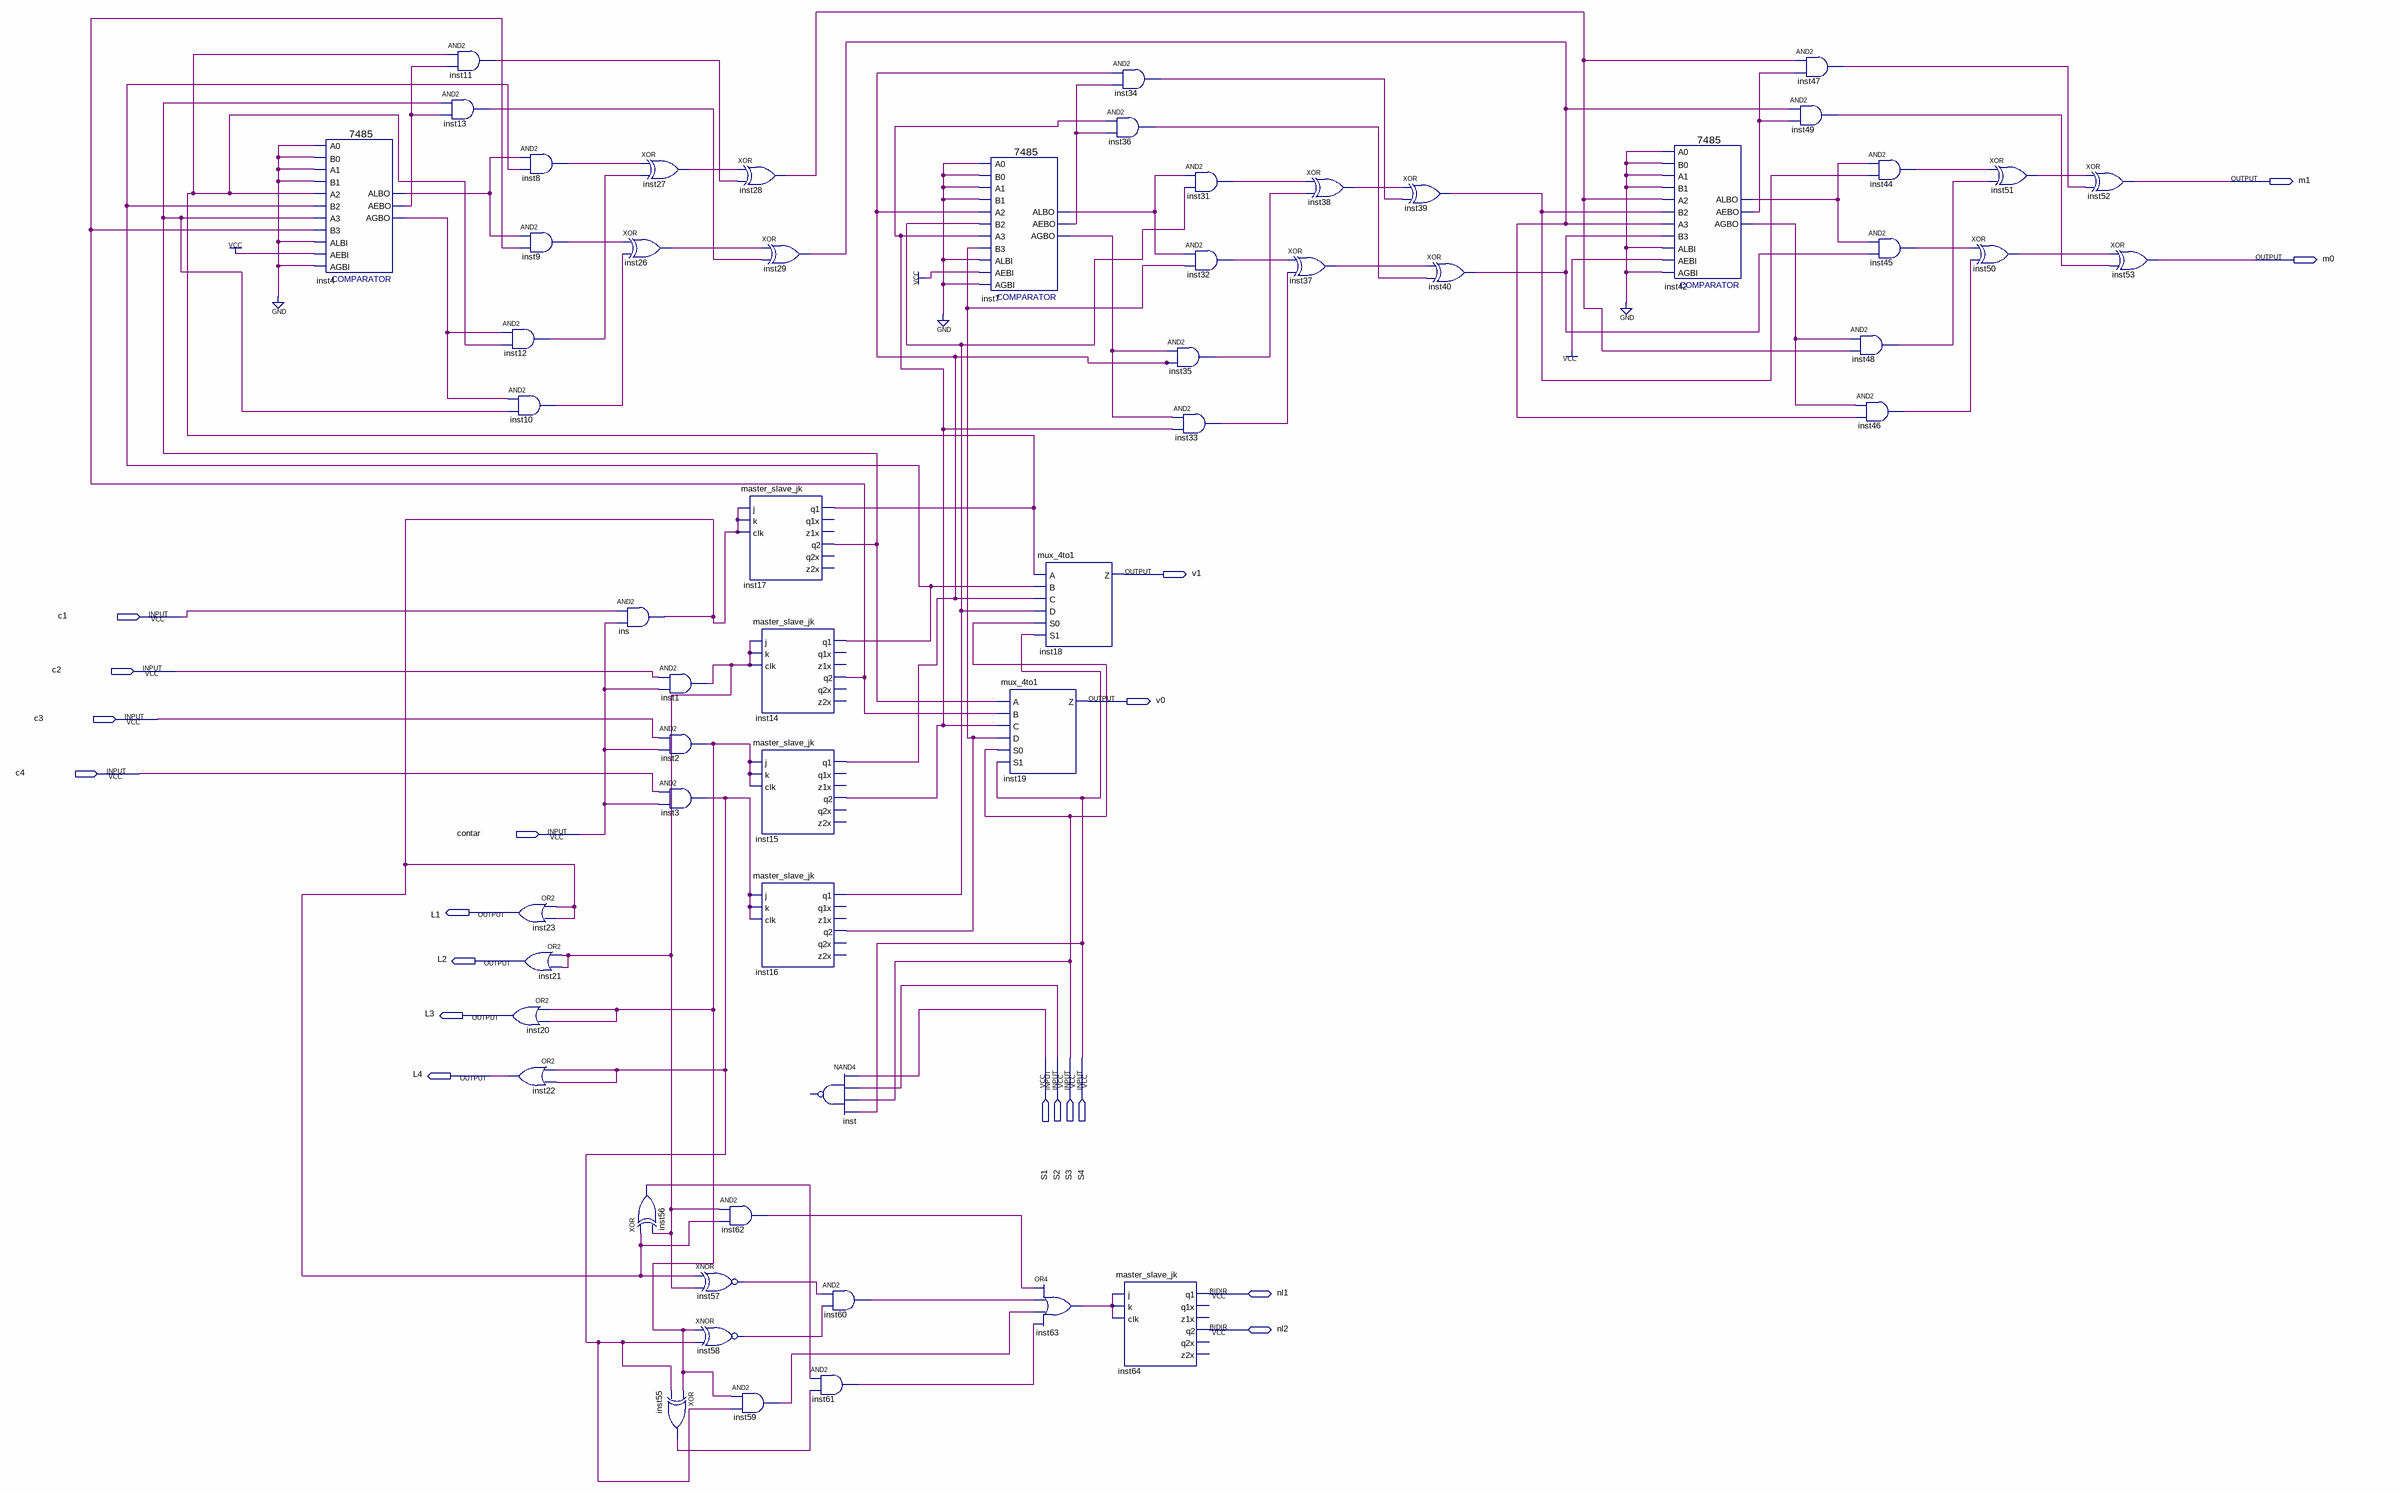
[diagram p0: schematic sheet]
// Quartus schematic SIMCONT.bdf as structural Verilog: 58 symbols, 19 pins
module SIMCONT (
  input  c1,
  input  c2,
  input  c3,
  input  c4,
  input  contar,
  input  S1,
  input  S2,
  input  S3,
  input  S4,
  inout  nl1,
  inout  nl2,
  output m1,
  output m0,
  output v1,
  output v0,
  output L1,
  output L2,
  output L3,
  output L4
);

  wire ins_out, inst1_out, inst2_out, inst3_out, inst4_aebo, inst4_agbo, inst4_albo, inst7_aebo, inst7_agbo,
       inst7_albo, inst8_out, inst9_out, inst10_out, inst11_out, inst12_out, inst13_out, inst14_q1,
       inst14_q2, inst15_q1, inst15_q2, inst16_q1, inst16_q2, inst17_q1, inst17_q2, inst26_out, inst27_out,
       inst28_out, inst29_out, inst31_out, inst32_out, inst33_out, inst34_out, inst35_out, inst36_out,
       inst37_out, inst38_out, inst39_out, inst40_out, inst42_aebo, inst42_agbo, inst42_albo, inst44_out,
       inst45_out, inst46_out, inst47_out, inst48_out, inst49_out, inst50_out, inst51_out, inst55_out,
       inst56_out, inst57_out, inst58_out, inst59_out, inst60_out, inst61_out, inst62_out, inst63_out;

  \7485  inst4 (
    .A3(inst17_q2), .B2(inst14_q1), .A2(inst17_q1), .AEBI(1'b1), .AGBI(1'b0), .ALBI(1'b0), .A0(1'b0),
    .B0(1'b0), .B3(inst14_q2), .A1(1'b0), .B1(1'b0), .ALBO(inst4_albo), .AGBO(inst4_agbo), .AEBO(inst4_aebo));
  and inst11 (inst11_out, inst17_q1, inst4_aebo);
  and inst13 (inst13_out, inst17_q2, inst4_aebo);
  and inst8 (inst8_out, inst4_albo, inst14_q1);
  and inst9 (inst9_out, inst4_albo, inst14_q2);
  and inst12 (inst12_out, inst4_agbo, inst17_q1);
  and inst10 (inst10_out, inst4_agbo, inst17_q2);
  or inst23 (L1, ins_out, ins_out);
  or inst21 (L2, inst1_out, inst1_out);
  or inst20 (L3, inst2_out, inst2_out);
  or inst22 (L4, inst3_out, inst3_out);
  xor inst26 (inst26_out, inst9_out, inst10_out);
  and ins (ins_out, c1, contar);
  xor inst27 (inst27_out, inst8_out, inst12_out);
  and inst1 (inst1_out, c2, contar);
  and inst2 (inst2_out, c3, contar);
  and inst3 (inst3_out, c4, contar);
  xor inst56 (inst56_out, ins_out, inst1_out);
  xor inst55 (inst55_out, inst2_out, inst3_out);
  and inst62 (inst62_out, inst1_out, ins_out);
  xnor inst57 (inst57_out, ins_out, inst1_out);
  xnor inst58 (inst58_out, inst2_out, inst3_out);
  xor inst28 (inst28_out, inst27_out, inst11_out);
  xor inst29 (inst29_out, inst26_out, inst13_out);
  master_slave_jk inst17 (
    .j(ins_out), .k(ins_out), .clk(ins_out), .q1(inst17_q1), .q2(inst17_q2));  // open: q1x, z1x, q2x, z2x
  master_slave_jk inst14 (
    .j(inst1_out), .k(inst1_out), .clk(inst1_out), .q1(inst14_q1), .q2(inst14_q2));  // open: q1x, z1x, q2x, z2x
  master_slave_jk inst15 (
    .j(inst2_out), .k(inst2_out), .clk(inst2_out), .q1(inst15_q1), .q2(inst15_q2));  // open: q1x, z1x, q2x, z2x
  master_slave_jk inst16 (
    .j(inst3_out), .k(inst3_out), .clk(inst3_out), .q1(inst16_q1), .q2(inst16_q2));  // open: q1x, z1x, q2x, z2x
  and inst59 (inst59_out, inst2_out, inst3_out);
  // NAND4 inst has open pins: IN1=S1, IN2=S2, IN3=S3, IN4=S4, OUT=open
  and inst61 (inst61_out, inst56_out, inst55_out);
  and inst60 (inst60_out, inst57_out, inst58_out);
  \7485  inst7 (
    .A3(inst15_q2), .B2(inst16_q1), .A2(inst15_q1), .AEBI(1'b1), .AGBI(1'b0), .ALBI(1'b0), .A0(1'b0),
    .B0(1'b0), .B3(inst16_q2), .A1(1'b0), .B1(1'b0), .ALBO(inst7_albo), .AGBO(inst7_agbo), .AEBO(inst7_aebo));
  mux_4to1 inst19 (.A(inst17_q2), .B(inst14_q2), .C(inst15_q2), .D(inst16_q2), .S0(S3), .S1(S4), .Z(v0));
  mux_4to1 inst18 (.A(inst17_q1), .B(inst14_q1), .C(inst15_q1), .D(inst16_q1), .S0(S3), .S1(S4), .Z(v1));
  or inst63 (inst63_out, inst62_out, inst60_out, inst59_out, inst61_out);
  and inst36 (inst36_out, inst15_q2, inst7_aebo);
  and inst34 (inst34_out, inst15_q1, inst7_aebo);
  master_slave_jk inst64 (
    .j(inst63_out), .k(inst63_out), .clk(inst63_out), .q1(nl1), .q2(nl2));  // open: q1x, z1x, q2x, z2x
  and inst31 (inst31_out, inst7_albo, inst16_q1);
  and inst32 (inst32_out, inst7_albo, inst16_q2);
  and inst35 (inst35_out, inst7_agbo, inst15_q1);
  and inst33 (inst33_out, inst7_agbo, inst15_q2);
  xor inst37 (inst37_out, inst32_out, inst33_out);
  xor inst38 (inst38_out, inst31_out, inst35_out);
  xor inst39 (inst39_out, inst38_out, inst34_out);
  xor inst40 (inst40_out, inst37_out, inst36_out);
  \7485  inst42 (
    .A3(inst29_out), .B2(inst39_out), .A2(inst28_out), .AEBI(1'b1), .AGBI(1'b0), .ALBI(1'b0), .A0(1'b0),
    .B0(1'b0), .B3(inst40_out), .A1(1'b0), .B1(1'b0), .ALBO(inst42_albo), .AGBO(inst42_agbo),
    .AEBO(inst42_aebo));
  and inst47 (inst47_out, inst28_out, inst42_aebo);
  and inst49 (inst49_out, inst29_out, inst42_aebo);
  and inst44 (inst44_out, inst42_albo, inst39_out);
  and inst45 (inst45_out, inst42_albo, inst40_out);
  and inst48 (inst48_out, inst42_agbo, inst28_out);
  and inst46 (inst46_out, inst42_agbo, inst29_out);
  xor inst50 (inst50_out, inst45_out, inst46_out);
  xor inst51 (inst51_out, inst44_out, inst48_out);
  xor inst52 (m1, inst51_out, inst47_out);
  xor inst53 (m0, inst50_out, inst49_out);
endmodule
